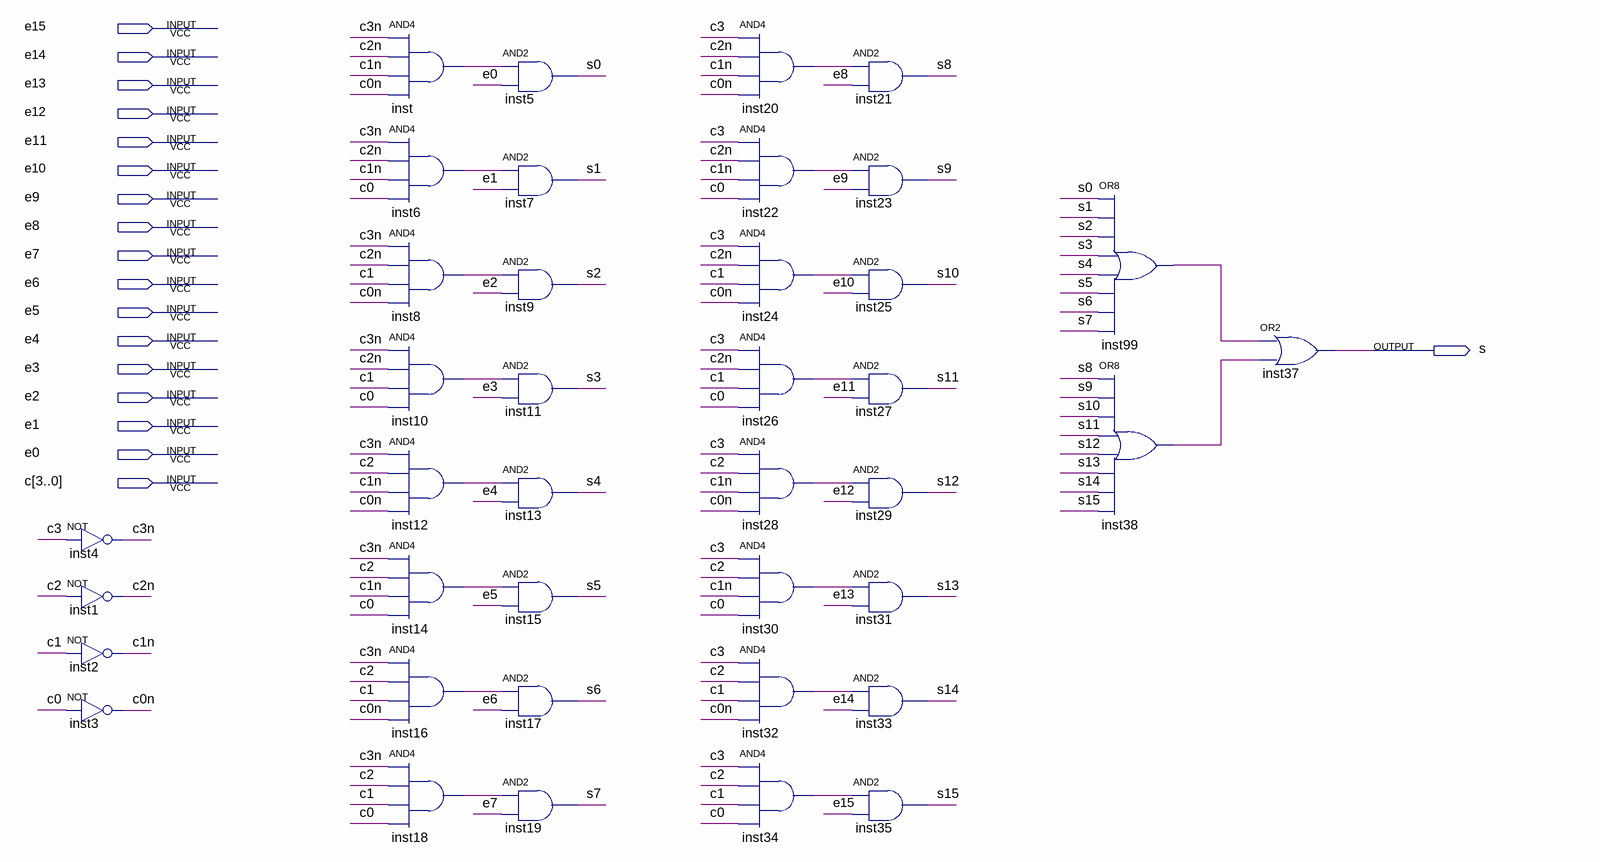
[diagram p0: schematic sheet]
// Quartus schematic jpd_mux_16x1.bdf as structural Verilog: 39 symbols, 18 pins
module jpd_mux_16x1 (
  input  e15,
  input  e14,
  input  e13,
  input  e12,
  input  e11,
  input  e10,
  input  e9,
  input  e8,
  input  e7,
  input  e6,
  input  e5,
  input  e4,
  input  e3,
  input  e2,
  input  e1,
  input  e0,
  input  [3:0] c,
  output s
);

  wire c0n, c1n, c2n, c3n, inst6_out, inst8_out, inst10_out, inst12_out, inst14_out, inst16_out, inst18_out,
       inst20_out, inst22_out, inst24_out, inst26_out, inst28_out, inst30_out, inst32_out, inst34_out,
       inst38_out, inst99_out, inst_out, s0, s1, s2, s3, s4, s5, s6, s7, s8, s9, s10, s11, s12, s13, s14, s15;

  not inst4 (c3n, c[3]);
  not inst1 (c2n, c[2]);
  not inst2 (c1n, c[1]);
  not inst3 (c0n, c[0]);
  and inst (inst_out, c3n, c2n, c1n, c0n);
  and inst6 (inst6_out, c3n, c2n, c1n, c[0]);
  and inst8 (inst8_out, c3n, c2n, c[1], c0n);
  and inst10 (inst10_out, c3n, c2n, c[1], c[0]);
  and inst12 (inst12_out, c3n, c[2], c1n, c0n);
  and inst14 (inst14_out, c3n, c[2], c1n, c[0]);
  and inst16 (inst16_out, c3n, c[2], c[1], c0n);
  and inst18 (inst18_out, c3n, c[2], c[1], c[0]);
  and inst5 (s0, inst_out, e0);
  and inst7 (s1, inst6_out, e1);
  and inst9 (s2, inst8_out, e2);
  and inst11 (s3, inst10_out, e3);
  and inst13 (s4, inst12_out, e4);
  and inst15 (s5, inst14_out, e5);
  and inst17 (s6, inst16_out, e6);
  and inst19 (s7, inst18_out, e7);
  and inst20 (inst20_out, c[3], c2n, c1n, c0n);
  and inst22 (inst22_out, c[3], c2n, c1n, c[0]);
  and inst24 (inst24_out, c[3], c2n, c[1], c0n);
  and inst26 (inst26_out, c[3], c2n, c[1], c[0]);
  and inst28 (inst28_out, c[3], c[2], c1n, c0n);
  and inst30 (inst30_out, c[3], c[2], c1n, c[0]);
  and inst32 (inst32_out, c[3], c[2], c[1], c0n);
  and inst34 (inst34_out, c[3], c[2], c[1], c[0]);
  and inst21 (s8, inst20_out, e8);
  and inst23 (s9, inst22_out, e9);
  and inst25 (s10, inst24_out, e10);
  and inst27 (s11, inst26_out, e11);
  and inst29 (s12, inst28_out, e12);
  and inst31 (s13, inst30_out, e13);
  and inst33 (s14, inst32_out, e14);
  and inst35 (s15, inst34_out, e15);
  or inst99 (inst99_out, s0, s1, s2, s3, s4, s5, s6, s7);
  or inst38 (inst38_out, s8, s9, s10, s11, s12, s13, s14, s15);
  or inst37 (s, inst99_out, inst38_out);
endmodule
